# EAGLE design avoccado-avr-pcb-faye (EAGLE 7.2.0)
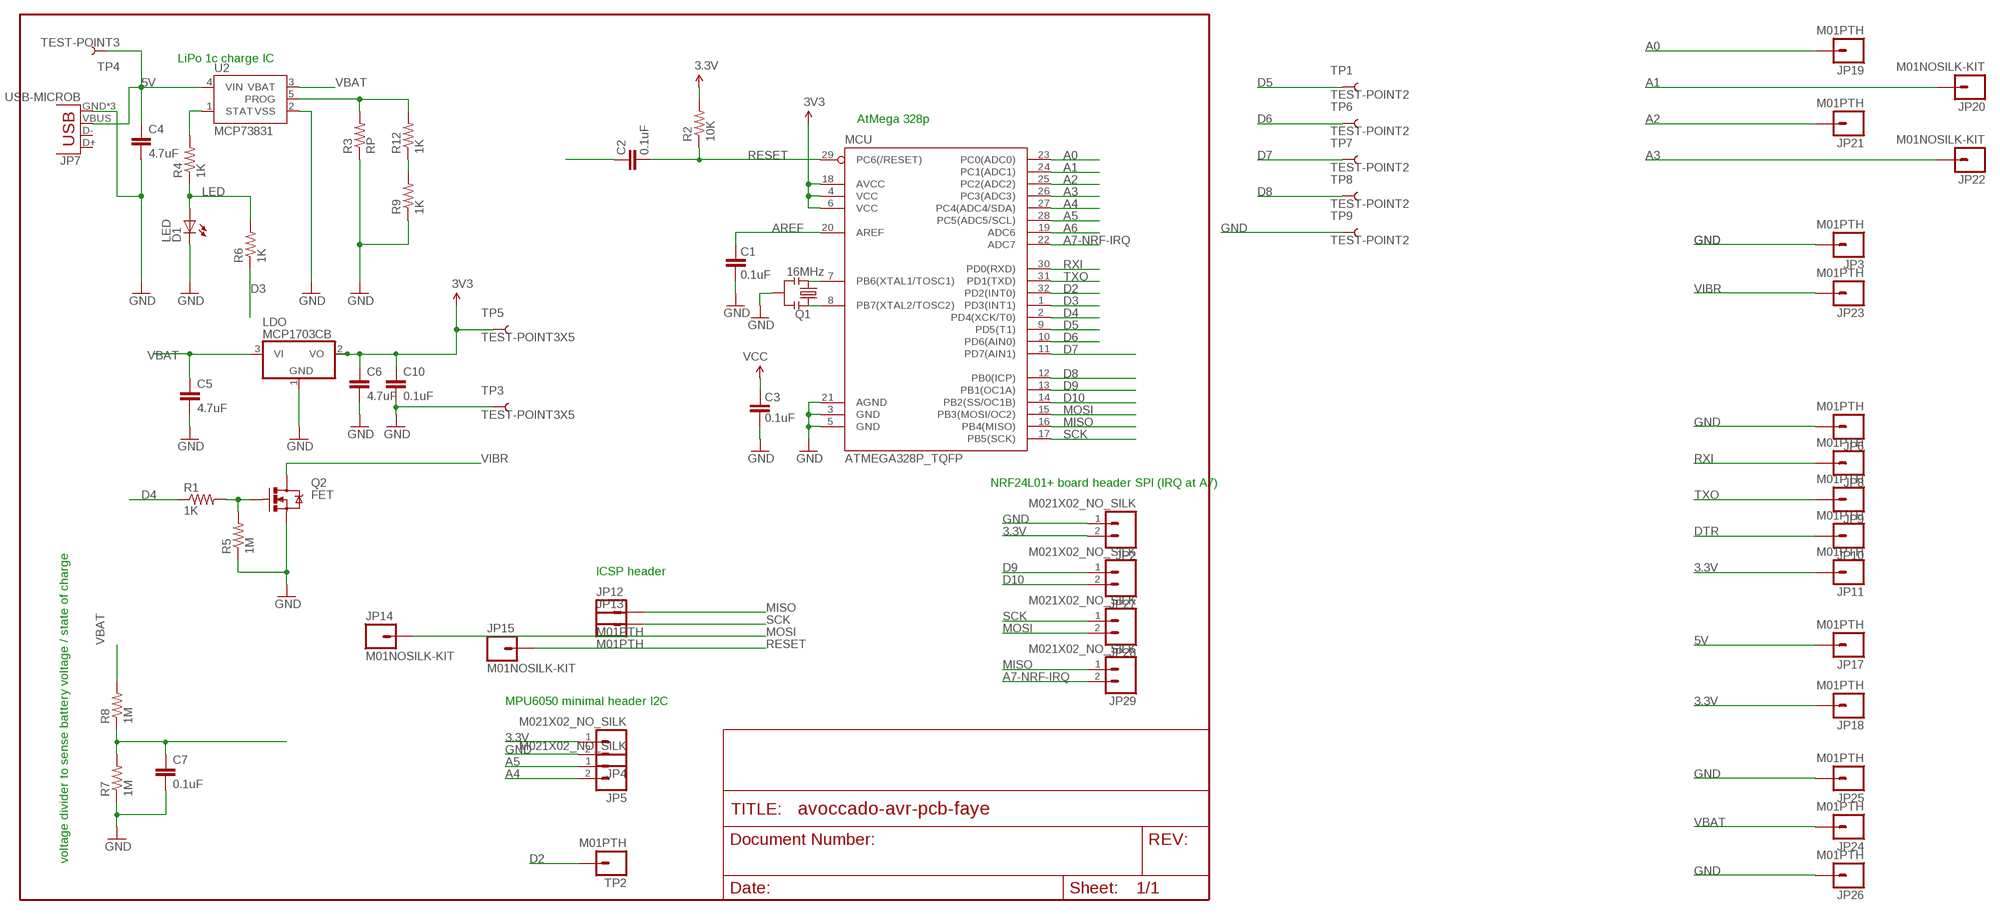
[diagram p0: schematic, sheet 1]

## Parts
C1  0.1uF  CAP0402  [C0402]
C2  0.1uF  CAP0402  [C0402]
C3  0.1uF  CAP0402  [C0402]
C4  4.7uF  4.7UF-6.3V-10%(0603)0603  [0603-CAP]
C5  4.7uF  4.7UF-6.3V-10%(0603)0603  [0603-CAP]
C6  4.7uF  4.7UF-6.3V-10%(0603)0603  [0603-CAP]
C7  0.1uF  CAP0402  [C0402]
C10  0.1uF  CAP0402  [C0402]
D1  LED  LED0603  [LED-0603]
JP2  M021X02_NO_SILK  [1X02_NO_SILK]
JP3  M01PTH  [1X01]
JP4  M021X02_NO_SILK  [1X02_NO_SILK]
JP5  M021X02_NO_SILK  [1X02_NO_SILK]
JP6  M01PTH  [1X01]
JP7  USB-MICROB  [USB-MICROB]
JP8  M01PTH  [1X01]
JP9  M01PTH  [1X01]
JP10  M01PTH  [1X01]
JP11  M01PTH  [1X01]
JP12  M01PTH  [1X01]
JP13  M01PTH  [1X01]
JP14  M01NOSILK-KIT  [1X01NS-KIT]
JP15  M01NOSILK-KIT  [1X01NS-KIT]
JP17  M01PTH  [1X01]
JP18  M01PTH  [1X01]
JP19  M01PTH  [1X01]
JP20  M01NOSILK-KIT  [1X01NS-KIT]
JP21  M01PTH  [1X01]
JP22  M01NOSILK-KIT  [1X01NS-KIT]
JP23  M01PTH  [1X01]
JP24  M01PTH  [1X01]
JP25  M01PTH  [1X01]
JP26  M01PTH  [1X01]
JP27  M021X02_NO_SILK  [1X02_NO_SILK]
JP28  M021X02_NO_SILK  [1X02_NO_SILK]
JP29  M021X02_NO_SILK  [1X02_NO_SILK]
LDO  MCP1703CB  [SOT23]
MCU  ATMEGA328P_TQFP  [TQFP32-08]
Q1  16MHz  RESONATORSMD  [RESONATOR-SMD]
Q2  FET  MOSFET-NCHANNELBSS123LT1G  [SOT23-3]
R1  1K  RESISTOR0603  [0603-RES]
R2  10K  RESISTOR0603  [0603-RES]
R3  RP  RESISTOR0603  [0603-RES]
R4  1K  RESISTOR0603  [0603-RES]
R5  1M  RESISTOR0603  [0603-RES]
R6  1K  RESISTOR0603  [0603-RES]
R7  1M  RESISTOR0603  [0603-RES]
R8  1M  RESISTOR0603  [0603-RES]
R9  1K  RESISTOR0402  [0402-RES]
R12  1K  RESISTOR0402  [0402-RES]
TP1  TEST-POINT2  [PAD.02X.02]
TP2  M01PTH  [1X01]
TP3  TEST-POINT3X5  [PAD.03X.05]
TP4  TEST-POINT3  [PAD.03X.03]
TP5  TEST-POINT3X5  [PAD.03X.05]
TP6  TEST-POINT2  [PAD.02X.02]
TP7  TEST-POINT2  [PAD.02X.02]
TP8  TEST-POINT2  [PAD.02X.02]
TP9  TEST-POINT2  [PAD.02X.02]
U2  MCP73831  [SOT23-5]

## Nets
3.3V: C3.2 C6.1 C10.1 JP2.2 JP4.1 JP11.1 JP18.1 LDO.2(VO) MCU.4(VCC) MCU.6(VCC) MCU.18(AVCC) R2.2 TP5.P$1 ; supply symbol labelled VCC, 3V3
5V: C4.1 JP7.VBUS JP17.1 TP4.P$1 U2.4(VIN)
A0: JP19.1 MCU.23(PC0(ADC0))
A1: JP20.1 MCU.24(PC1(ADC1))
A2: JP21.1 MCU.25(PC2(ADC2))
A3: C7.1 JP22.1 MCU.26(PC3(ADC3)) R7.2 R8.1
A4: JP5.2 MCU.27(PC4(ADC4/SDA))
A5: JP5.1 MCU.28(PC5(ADC5/SCL))
A6: MCU.19(ADC6)
A7-NRF-IRQ: JP29.2 MCU.22(ADC7)
AREF: C1.2 MCU.20(AREF)
CHG-PROG: R3.2 R12.2 U2.5(PROG)
D2: MCU.32(PD2(INT0)) TP2.1
D3: MCU.1(PD3(INT1)) R6.1
D4: MCU.2(PD4(XCK/T0)) R1.1
D5: MCU.9(PD5(T1)) TP1.P$1
D6: MCU.10(PD6(AIN0)) TP6.P$1
D7: MCU.11(PD7(AIN1)) TP7.P$1
D8: MCU.12(PB0(ICP)) TP8.P$1
D9: JP27.1 MCU.13(PB1(OC1A))
D10: JP27.2 MCU.14(PB2(SS/OC1B))
DTR: C2.2 JP10.1
GND [vcc]: C1.1 C3.1 C4.2 C5.2 C6.2 C7.2 C10.2 D1.C JP2.1 JP3.1 JP4.2 JP6.1 JP7.GND JP7.MT1(GND) JP7.MT2(GND) JP25.1 JP26.1 LDO.1(GND) MCU.3(GND) MCU.5(GND) MCU.21(AGND) Q1.2 Q2.2(S) R3.1 R5.1 R7.1 R9.1 TP3.P$1 TP9.P$1 U2.2(VSS)
LED: D1.A R4.1 R6.2
MISO: JP12.1 JP29.1 MCU.16(PB4(MISO))
MOSI: JP14.1 JP28.2 MCU.15(PB3(MOSI/OC2))
N$1: MCU.8(PB7(XTAL2/TOSC2)) Q1.1
N$2: MCU.7(PB6(XTAL1/TOSC1)) Q1.3
N$3: R9.2 R12.1
N$6: Q2.1(G) R1.2 R5.2
RESET: C2.1 JP15.1 MCU.29(PC6(/RESET)) R2.1
RXI: JP8.1 MCU.30(PD0(RXD))
SCK: JP13.1 JP28.1 MCU.17(PB5(SCK))
SOC: R4.2 U2.1(STAT)
TXO: JP9.1 MCU.31(PD1(TXD))
VBAT [vcc]: C5.1 JP24.1 LDO.3(VI) R8.2 U2.3(VBAT)
VIBR: JP23.1 Q2.3(D)
Unconnected: JP7.D+ JP7.D-

## Notes on the sheet
- LiPo 1c charge IC
- AtMega 328p
- NRF24L01+ board header SPI (IRQ at A7)
- ICSP header
- MPU6050 minimal header I2C
- voltage divider to sense battery voltage / state of charge

## Library data of the parts
C1-C3 C7 C10 = SparkFun:CAP: Capacitor Standard 0603 ceramic capacitor, and 0.1" leaded capacitor.
C4-C6 = SparkFun-Capacitors:4.7UF-6.3V-10%(0603): CAP-08280; PROD_ID: CAP-08280
D1 = SparkFun:LED: LEDs Standard schematic elements and footprints for 5mm, 3mm, 1206, and 0603 sized LEDs. 5mm - Spark Fun Electronics SKU : COM-00529 (and others)
JP2 JP4 JP5 JP27-JP29 = SparkFun-Connectors:M02: Standard 2-pin 0.1" header. Use with - straight break away headers ( PRT-00116) - right angle break away headers (PRT-00553) - swiss pins (PRT-00743) - machine pins (PRT-00117) - female headers (PRT-00115) Molex polarized connector foot print use with: PRT-08233 with associated crimp pins and housings. 2.54_SCREWTERM for use with PRT-10571. 3.5mm Screw Terminal footprints for PRT-08084 5mm Screw Terminal footprints for use with PRT-08432
JP3 JP6 JP8-JP15 JP17-JP26 TP2 = SparkFun-Connectors:M01: Header 1 Standard 1-pin 0.1" header. Use with straight break away headers (SKU : PRT-00116), right angle break away headers (PRT-00553), swiss pins (PRT-00743), machine pins (PRT-00117), and female headers (PRT-00115).
JP7 = SparkFun-Connectors:USB: USB Connectors USB-B-PTH is fully proven SKU : PRT-00139/CONN-08278 USB-miniB is fully proven SKU : PRT-00587 USB-A-PCB is untested. USB-A-H is throughly reviewed, but untested. Spark Fun Electronics SKU : PRT-00437 USB-B-SMT is throughly reviewed, but untested. Needs silkscreen touching up. USB-A-S has not been used/tested USB-MB-H has not been used/tested USB-MICROB has been used. CONN-09505; PROD_ID: CONN-09505
LDO = linear:MCP1703: 250 mA, 16V, Low Quiescent Current LDO Regulator Source: http://ww1.microchip.com/downloads/en/DeviceDoc/22049b.pdf
MCU = SparkFun-DigitalIC:ATMEGA328P_TQFP; PROD_ID: IC-09069
Q1 = SparkFun:RESONATOR: Resonator Small SMD resonator. This is the itty bitty 10/20MHz resonators with built in caps. CSTCE10M0G55 and CSTCE20M0V53. Footprint has been reviewed closely but hasn't been tested yet.
Q2 = SparkFun-DiscreteSemi:MOSFET-NCHANNEL: Common NMOSFET Parts MFG P/N Store ID Prod ID FDD8780 TRANS-09984 SI7820DN TRANS-11055 FDS6630A IC-08089 2N7002PW TRANS-11151 FQP30N06L COM-10213 TRANS-10060 BSS123LT1G TRANS-08345 BSS138 TRANS-00830 BS170 2N7000; PROD_ID: TRANS-08345
R1-R9 R12 = SparkFun-Resistors:RESISTOR: Resistor Basic schematic elements and footprints for 0603, 1206, and PTH resistors.
TP1 TP3-TP9 = SparkFun-Passives:TEST-POINT: Bare copper test points for troubleshooting or ICT
U2 = SparkFun:MCP73831: Microchip's MCP73831 Miniature single cell, fully integrated Li-Ion, Li-polymer charge management controller http://ww1.microchip.com/downloads/en/DeviceDoc/21984a.pdf

## Net classes
1 vcc: width 0.254 mm
3 usbvcc: width 0.203 mm, drill 0.61 mm, clearance 0.152 mm

## Board
Avoccado PCB AVR
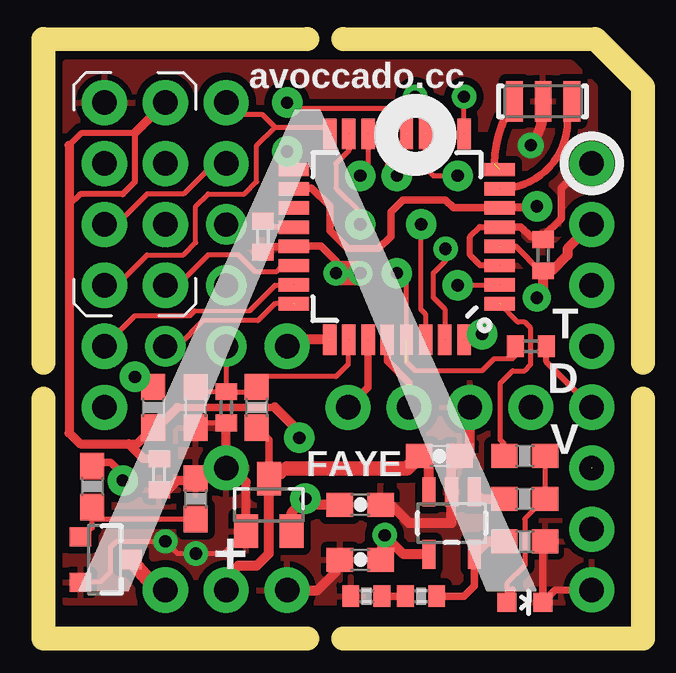
[diagram p1: board, top side]
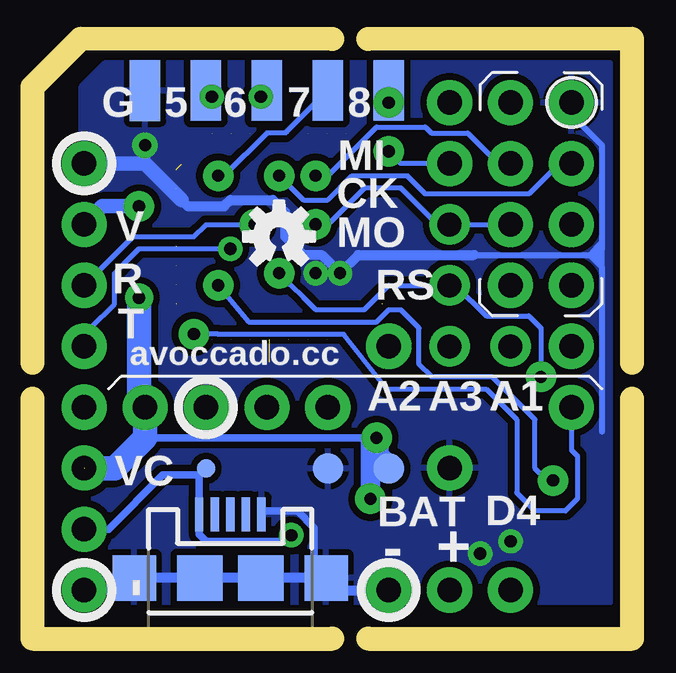
[diagram p2: board, bottom side, seen from below]

No outline drawn. Coordinates in mm, seen from the top.
Copper layers (1*16): Top 0.035mm / dielectric 1.5mm / Bottom 0.035mm
Design rules "dirt_cheap_dirty_boards.v1 *": minimum track width 5mil, minimum drill 12mil, track to track 5mil, track to pad 5mil, pad to pad 5mil, via to via 5mil, smd to smd 0mil, copper to edge 10mil, drill to drill 10mil, minimum pad ring 10mil, minimum via ring 6mil, stop-mask expansion 0mil, vias tented up to drill 25mil, thermal gap 10mil
tRestrict: area 10.2,12.2 to 18.3,20.3
Milling: 9 lines

### Footprints (pad centres in the part's own frame; a part is rotated, then mirrored left to right if it is on the bottom)
C0402 = smd 0.7 x 0.9: 1 -0.65,0; 2 0.65,0
0603-CAP = smd 1.1 x 1: 1 -0.85,0; 2 0.85,0
LED-0603 = smd 0.8 x 0.8: A 0,-0.75; C 0,0.75
1X02_NO_SILK = drill 1.016 pad 1.88: 1 0,0; 2 2.54,0
1X01 = drill 1.016 pad 1.88: 1 0,0
USB-MICROB = smd 0.35 x 1.4: D+ 0,2.65; D- -0.65,2.65; GND 1.3,2.65; ID 0.65,2.65; VBUS -1.3,2.65 | smd 1.8 x 1.9: MT1 -4,0; MT2 4,0 | smd 1.9 x 1.9: P$1 -1.27,0; P$2 1.27,0
1X01NS-KIT = drill 1 pad 1.676: 1 0,0
SOT23 = smd 1 x 1.4: 1 -0.95,-1.1; 2 0.95,-1.1; 3 0,1.1
TQFP32-08 = smd 1.27 x 0.559: 1 -4.293,2.8; 2 -4.293,2; 3 -4.293,1.2; 4 -4.293,0.4; 5 -4.293,-0.4; 6 -4.293,-1.2; 7 -4.293,-2; 8 -4.293,-2.8; 17 4.293,-2.8; 18 4.293,-2; 19 4.293,-1.2; 20 4.293,-0.4; 21 4.293,0.4; 22 4.293,1.2; 23 4.293,2; 24 4.293,2.8 | smd 0.559 x 1.27: 9 -2.8,-4.293; 10 -2,-4.293; 11 -1.2,-4.293; 12 -0.4,-4.293; 13 0.4,-4.293; 14 1.2,-4.293; 15 2,-4.293; 16 2.8,-4.293; 25 2.8,4.293; 26 2,4.293; 27 1.2,4.293; 28 0.4,4.293; 29 -0.4,4.293; 30 -1.2,4.293; 31 -2,4.293; 32 -2.8,4.293
RESONATOR-SMD = smd 0.7 x 1.7: 1 -1.2,0; 2 0,0; 3 1.2,0
SOT23-3 = smd 0.8 x 0.9: 1 -0.95,-1; 2 0.95,-1; 3 0,1.1
0603-RES = smd 1.1 x 1: 1 -0.85,0; 2 0.85,0
0402-RES = smd 0.7 x 0.9: 1 -0.65,0; 2 0.65,0
PAD.02X.02 = smd 2.54 x 1.27: P$1 0,0
PAD.03X.05 = smd 1.27 x 1.27: P$1 0,0
PAD.03X.03 = smd 0.762 x 0.762: P$1 0,0
SOT23-5 = smd 0.55 x 1.2: 1 -0.95,-1.3; 2 0,-1.3; 3 0.95,-1.3; 4 0.95,1.3; 5 -0.95,1.3

### Placement (x,y rotation side)
C1  8.64,16.26 90 top
C2  19.81,11.69 0 top
C3  20.32,15.49 270 top
C4  12.7,2.79 180 top
C5  16,7.11 0 top
C6  12.7,5.08 0 top
C7  7.11,9.14 270 top
C10  4.32,6.35 270 top
D1  19.56,1.02 270 top
JP2  2.03,21.85 0 top
JP3  22.35,19.31 0 top
JP4  19.81,9.14 180 top
JP5  14.73,9.14 180 top
JP6  7.11,6.61 0 top
JP7  16.26,2.03 0 bottom
JP8  22.35,14.23 0 top
JP9  22.35,11.69 0 top
JP10  22.35,9.15 0 top
JP11  22.35,16.77 0 top
JP12  7.11,21.85 0 top
JP13  7.11,19.31 0 top
JP14  7.11,16.77 0 top
JP15  7.11,14.23 0 top
JP17  22.35,4.06 0 top
JP18  22.35,6.61 0 top
JP19  2.03,11.69 90 top
JP20  4.57,11.69 90 top
JP21  9.65,11.69 90 top
JP22  7.11,11.69 90 top
JP23  4.57,1.52 0 top
JP24  7.11,1.52 0 top
JP25  9.65,1.52 0 top
JP26  22.35,1.53 0 top
JP27  2.03,19.31 0 top
JP28  2.03,16.77 0 top
JP29  2.03,14.23 0 top
LDO  8.89,5.08 0 top
LOGO2  OSHW-LOGOS  [OSHW-LOGO-S]  14.22,16.26 0 bottom
MCU  14.22,16.26 180 top
Q1  20.32,21.9 0 top
Q2  2.03,2.79 270 top
R1  1.52,5.84 270 top
R2  4.06,9.14 270 top
R3  19.56,3.56 180 top
R4  19.56,5.33 180 top
R5  5.84,5.33 270 top
R6  19.56,7.11 0 top
R7  5.84,9.14 90 top
R8  8.38,9.14 270 top
R9  12.95,1.27 0 top
R12  15.24,1.27 0 top
TP1  17.27,22.36 270 bottom
TP2  2.03,9.14 0 top
TP3  12.19,6.6 0 bottom
TP4  17.27,6.6 0 bottom
TP5  9.65,6.6 0 bottom
TP6  14.73,22.36 270 bottom
TP7  12.19,22.36 270 bottom
TP8  9.65,22.36 270 bottom
TP9  19.81,22.35 270 bottom
U2  16.51,4.32 180 top

### Tracks (layer width: path | path; a pad name or v marks a point on that pad's centre or on a via)
3.3V  (via drill 0.51 pad 1.17, 0.51 pad 1.27)  (3 unrouted)
  Top 0.203: MCU.18 9.96,18.3
  Top 0.254: 9.9,18.3 MCU.18 | 3.3,20.58 3.3,20.57 | 3.3,20.57 1.06,20.57 0.56,20.07 | MCU.4 19.19,15.86 20.22,14.84 C3.2 | 3.3,20.57 3.3,18.54 2.79,18.03 1.02,18.03 0.51,17.53 0.51,17.27 | MCU.6 18.59,17.53 v20.07,17.53
  Top 0.305: 9.96,18.3 10.67,18.3 11.43,17.53 11.43,16.52 12.19,15.76 13.46,15.76 13.97,16.26 13.97,17.28 14.48,17.79 16.26,17.79 16.58,17.46 20,17.46 v20.07,17.53 | 5.08,9.14 9.14,9.14
  Top 0.381: JP2.2 3.3,20.58 | 0.56,20.07 0.56,8.08 1.02,7.62 3.05,7.62 | 3.05,7.62 3.39,7.62 R2.2 4.23,8.29 5.08,9.14 | C10.1 3.67,7 3.05,7.62
  Top 0.406: v10.16,7.87 10.16,8.13 9.14,9.14 | JP11.1 21.34,15.76 21.34,15.49 20.68,14.84 C3.2 20.32,13.97 v20.07,13.72 | LDO.2 9.84,4.76 v10.41,5.33 10.67,5.08 C6.1
  Top 0.61: LDO.2
  Bottom 0.305: v10.16,7.87 19.56,7.87 19.81,8.13
  Bottom 0.61: v20.07,17.53 21.6,17.53 JP11.1
  Bottom 0.813: v10.41,5.33 10.41,7.62 v10.16,7.87
  Bottom 1.016: v20.07,13.72 20.07,9.4 JP4.1 19.81,8.13 19.81,7.87 21.08,6.6 JP18.1 | v10.16,7.87 10.16,7.11 TP5.P$1
5V  (via drill 0.51 pad 1.02)
  Top 0.406: U2.4 14.51,3.02 v13.72,3.81
  Top 0.61: 13.63,3.98 v13.72,3.81 13.72,2.96 C4.1
  Bottom 0.305: 17.56,6.32 JP7.VBUS 17.56,3.84 17.27,3.56 13.97,3.56 v13.72,3.81 | JP17.1 21.34,4.06 19.08,6.32 17.56,6.32 | 17.56,6.32 TP4.P$1
A0  (1 unrouted)
  Top 0.178: 8.08,13.16 5.79,13.16
  Top 0.203: MCU.23 9.9,14.23 9.14,14.23 8.08,13.16 | 5.79,13.16 5.59,12.96 3.3,12.96 JP19.1
A1  (1 unrouted)
  Top 0.203: MCU.24 9.14,13.46 8.43,12.76 6.15,12.76 5.08,11.69 JP20.1
A2  (1 unrouted)
  Top 0.406: MCU.25 9.42,11.97 JP21.1
A3  (1 unrouted)
  Top 0.203: MCU.26 12.19,11.94 12.19,10.93 11.68,10.42 8.64,10.42 8.13,9.91 R8.1 8.18,9.79 C7.1 | JP22.1 C7.1 | C7.1 6.04,9.79 R7.2
A4  (1 unrouted)
  Top 0.305: MCU.27 13.02,9.98 JP5.2
A5  (1 unrouted)
  Top 0.305: MCU.28 13.82,11.07 14.73,10.16 JP5.1
A7-NRF-IRQ
  Top 0.203: JP29.2 5.08,14.23 6.35,15.5 7.62,15.5 8.31,14.81 9.22,14.81 9.4,14.99 9.86,14.99 MCU.22
AREF
  Top 0.254: MCU.20 8.89,16.66 C1.2
CHG-PROG
  Top 0.305: U2.5 17.46,1.71 17.02,1.27 R12.2
  Top 0.406: U2.5 18,3.56 R3.2
D2  (via drill 0.51 pad 1.27)  (1 unrouted)
  Top 0.203: MCU.32 17.25,12.2 v17.78,12.2
  Bottom 0.203: v17.78,12.2 16.77,12.2 16.76,12.19 11.53,12.19 9.75,9.91 5.59,9.91 4.32,8.64 4.32,5.59 3.56,4.83 2.29,4.83 1.78,5.33 1.78,7.11 2.03,7.37 TP2.1
D3  (1 unrouted)
  Top 0.203: 18.03,13.46 18.04,13.46 | 18.03,13.46 18.04,13.46 | 18.04,13.46 MCU.1 19.28,12.7 19.56,12.7 19.81,12.45 19.81,10.92 19.56,10.67 19.05,10.67 18.54,10.16 18.54,7.78 18.71,7.61 R6.1
D4  (via drill 0.51 pad 1.27)  (1 unrouted)
  Top 0.203: MCU.2 18.48,14.23 v16.76,14.23
  Top 0.305: v2.79,6.1 2.79,6.35 2.29,6.86 1.69,6.86 R1.1
  Bottom 0.203: v16.76,14.23 15.49,12.71 10.16,12.71 9.66,13.21 9.65,13.21 9.14,13.21 8.38,12.45 8.38,10.93 7.87,10.42 5.34,10.42 3.56,8.64 3.56,6.6 3.05,6.1 v2.79,6.1
D5  (via drill 0.51 pad 1.02)  (1 unrouted)
  Top 0.203: MCU.9 v17.02,22.1
  Bottom 0.406: v17.02,22.1 TP1.P$1
D6  (via drill 0.51 pad 1.02)  (1 unrouted)
  Top 0.203: MCU.10 16.22,21.38 15.76,21.84 15.24,21.84 v14.99,22.1
  Bottom 0.203: v14.99,22.1 TP6.P$1
D7  (via drill 0.51 pad 1.27)  (1 unrouted)
  Top 0.203: MCU.11 15.42,19.13 15.75,18.8 v16.76,18.8
  Bottom 0.203: v16.76,18.8 16.51,18.8 14.73,20.58 13.97,20.58 TP7.P$1
D8  (via drill 0.51 pad 1.27)  (1 unrouted)
  Top 0.203: MCU.12 14.62,21.2 14.22,21.6 10.16,21.6 v9.65,21.85
  Bottom 0.61: TP8.P$1 v9.65,21.85
D9  (via drill 0.51 pad 1.27)  (1 unrouted)
  Top 0.203: MCU.13 13.82,19.2 v14.22,18.8
  Bottom 0.203: JP27.1 2.54,19.31 3.81,18.04 8.13,18.04 8.89,18.8 11.18,18.8 12.19,17.79 13.21,17.79 v14.22,18.8
D10  (via drill 0.51 pad 1.27)  (1 unrouted)
  Top 0.203: MCU.14 13.02,19.13 v12.7,18.8
  Bottom 0.203: v12.7,18.8 12.19,18.8 10.16,20.84 8.13,20.84 7.87,20.58 6.35,20.58 5.08,19.31 JP27.2
DTR
  Top 0.254: JP10.1 20.46,11.03 C2.2
GND  (via drill 0.51 pad 1.02, 0.51 pad 1.07)  (1 unrouted)
  Top 0.203: 7.87,4.05 LDO.1 7.01,3.05 5.08,3.05 v4.57,3.56 2.54,3.56 2.29,3.3 2.29,2.29 1.89,1.89 Q2.2 | C7.2 6.04,8.49 R7.1
  Top 0.254: MCU.3 17.7,15.06 17.27,15.49 17.27,16.26 17.68,16.66 MCU.5
  Top 0.305: v11.68,14.74 11.68,15.24 11.07,15.86 MCU.21 8.9,15.86 C1.1 | MCU.5 19.4,16.66 19.81,16.26 20.2,16.26 C3.1 20.32,16.26 21.08,17.02 21.08,18.29 22.11,19.31 JP3.1 | R3.1 20.31,3.46 D1.C 20.82,1.52 JP26.1
  Top 0.381: LDO.1 7.94,6.03 7.11,6.86 | 7.11,6.86 C7.2 | 7.11,6.86 6.44,6.18 R5.1 6.01,6.1 5.08,6.1 4.68,5.7 C10.2
  Top 0.406: Q1.2 20.32,21.6 arc-37 v19.81,20.07 | JP25.1 10.92,1.52 11.68,2.29 | JP4.2 17.27,7.2 C5.2 16.76,7.11 16.51,6.62 U2.2 16.51,4.32 14.73,4.32 13.97,5.08 C6.2
  Top 1.016: v11.68,14.74 v12.7,14.74
  Bottom 0.254: JP2.1 2.03,21.34 0.76,20.07 0.76,16.01 | 0.76,14.99 0.76,8.14 | 6.1,15.5 1.27,15.5 | 1.27,15.5 1.02,15.76 | 1.02,15.76 0.76,16.01 | 1.27,15.5 1.02,15.25 | 1.02,15.25 0.76,14.99 | 0.76,16.01 0.76,15.76 | 0.76,15.76 1.02,15.5 1.02,15.25 | 0.76,14.99 0.76,15.76 | 0.76,15.76 1.02,15.76
  Bottom 0.305: JP7.GND 14.81,4.83 13.46,4.83 12.76,4.13 12.76,2.6 12.7,2.54 JP7.MT2
  Bottom 0.406: 18.29,17.79 18.03,17.53 16.51,17.53 16.25,17.79 14.48,17.79 13.97,17.28 13.97,16.26 13.21,15.49 12.44,15.49 v11.68,14.74 10.92,15.5 6.1,15.5 | v19.81,20.07 19.81,19.31 | 20.82,1.53 JP26.1 20.32,1.53 20.31,1.52 20.31,1.98 JP7.MT1 JP7.MT2 12.26,1.52 JP25.1
  Bottom 0.61: JP3.1 19.81,19.31 18.29,17.79
  other vias: 5.84,3.05
  pour Bottom (isolate 0.279): 0.4,23.51 21.49,23.51 22.49,22.51 22.49,1.01 0.4,1.01
  pour Top (isolate 0.305): 0.4,23.51 0.4,1.01 22.49,1.01 22.49,22.51 21.49,23.51
LED
  Top 0.203: R6.2 R4.1 19.56,4.49 19.56,2.54 18.82,1.8 D1.A
  Top 0.305: D1.A 19.05,1.54
MISO  (1 unrouted)
  Top 0.203: 11.43,20.07 MCU.16 11.14,20.84 9.14,20.84 | JP29.1 2.54,14.23 3.81,15.5 5.33,15.5 5.84,16.01 5.84,17.53 6.35,18.04 7.87,18.04 8.38,18.55 8.38,20.07 9.14,20.84 | 9.14,20.84 8.64,21.34 7.62,21.34 JP12.1
MOSI  (via drill 0.51 pad 1.27)  (1 unrouted)
  Top 0.203: MCU.15 12.22,19.85 11.68,19.31 11.68,18.3 12.7,17.28 v12.7,16.77
  Bottom 0.203: v12.7,16.77 12.19,16.77 10.67,18.3 9.14,18.3 7.62,16.77 JP14.1 JP28.2 4.83,16.77
N$1  (1 unrouted)
  Top 0.254: 18.29,19.29 18.29,19.31
  Top 0.305: 18.29,19.31 arc-33 Q1.1
N$2  (1 unrouted)
  Top 0.254: 21.34,21.34 arc90 21.52,21.53 Q1.3
  Top 0.305: MCU.7 arc90 21.34,21.08 21.34,21.34
N$3
  Top 0.305: R12.1 R9.2
N$6
  Top 0.203: Q2.1 1.52,4.12 1.52,4.57 | R5.2 1.61,4.48 1.52,4.57 | 1.52,4.57 R1.2
RESET  (via drill 0.51 pad 1.27)  (1 unrouted)
  Top 0.203: v14.22,14.74 14.62,14.34 14.62,11.04 14.99,10.68 17.79,10.68 18.29,11.18 19.05,11.18 19.42,11.54 C2.1 | v3.3,10.41 3.72,9.99 R2.1
  Bottom 0.203: v14.22,14.74 v14.22,14.73 13.72,14.22 13.2,13.72 12.7,13.22 10.67,13.22 9.65,14.23 JP15.1 6.87,14.23 5.59,12.95 3.81,12.95 3.3,12.45 v3.3,10.41
RXI  (via drill 0.51 pad 1.27)  (1 unrouted)
  Top 0.203: MCU.30 15.42,13.03 15.24,13.22 v15.24,16.77
  Bottom 0.203: v15.24,16.77 v15.25,16.76 17.27,16.76 17.78,16.26 20.31,16.26 21.84,14.73 JP8.1
SCK  (via drill 0.51 pad 1.27)  (1 unrouted)
  Top 0.203: JP28.1 2.54,16.77 3.81,18.04 5.33,18.04 6.6,19.31 JP13.1
  Top 0.406: v9.65,19.82 9.94,19.57 MCU.17
  Bottom 0.203: JP13.1 9.14,19.31 v9.65,19.82
SOC
  Top 0.406: U2.1 17.74,5.33 R4.2
TXO  (via drill 0.51 pad 1.02)  (1 unrouted)
  Top 0.203: MCU.31 16.22,13.25 15.75,13.72 15.75,14.74 16.26,15.25 v16.26,15.76
  Bottom 0.203: 20.07,15.76 v16.26,15.76 | 20.07,15.76 20.07,15.75 | JP9.1 22.09,11.69 22.09,12.45 21.08,13.46 21.08,14.73 20.57,15.24 20.07,15.75 20.07,15.76
VBAT
  Top 0.305: R8.2 8.89,7.79 LDO.3
  Top 0.406: LDO.3 8.89,3.05 8.38,2.54 7.62,2.54 7.11,2.03 JP24.1 | U2.3 15.56,7.01 C5.1 | 9.06,6.35 9.4,6.35 9.65,6.6
  Top 0.61: 9.06,6.35 LDO.3 8.72,6.35 | 9.65,6.6 14.64,6.6 C5.1
VIBR
  Top 0.61: Q2.3 4.23,1.52 JP23.1

### Text on the board
tPlace: avoccado.cc | T | D | V | FAYE | +
bPlace: 8 | 7 | 6 | 5 | G | MI | CK | V | MO | R | RS | T | avoccado.cc | A1 | A3 | A2 | VC | D4 | BAT | + | - | -